# EasyEDA schematic Bravo-Flash Programmer.json
TITLE: Sheet_1; REV: 1.0; Date: 2021-12-21; Sheet: 1/1; Drawn By: kavehmajidi; Company: Your Company
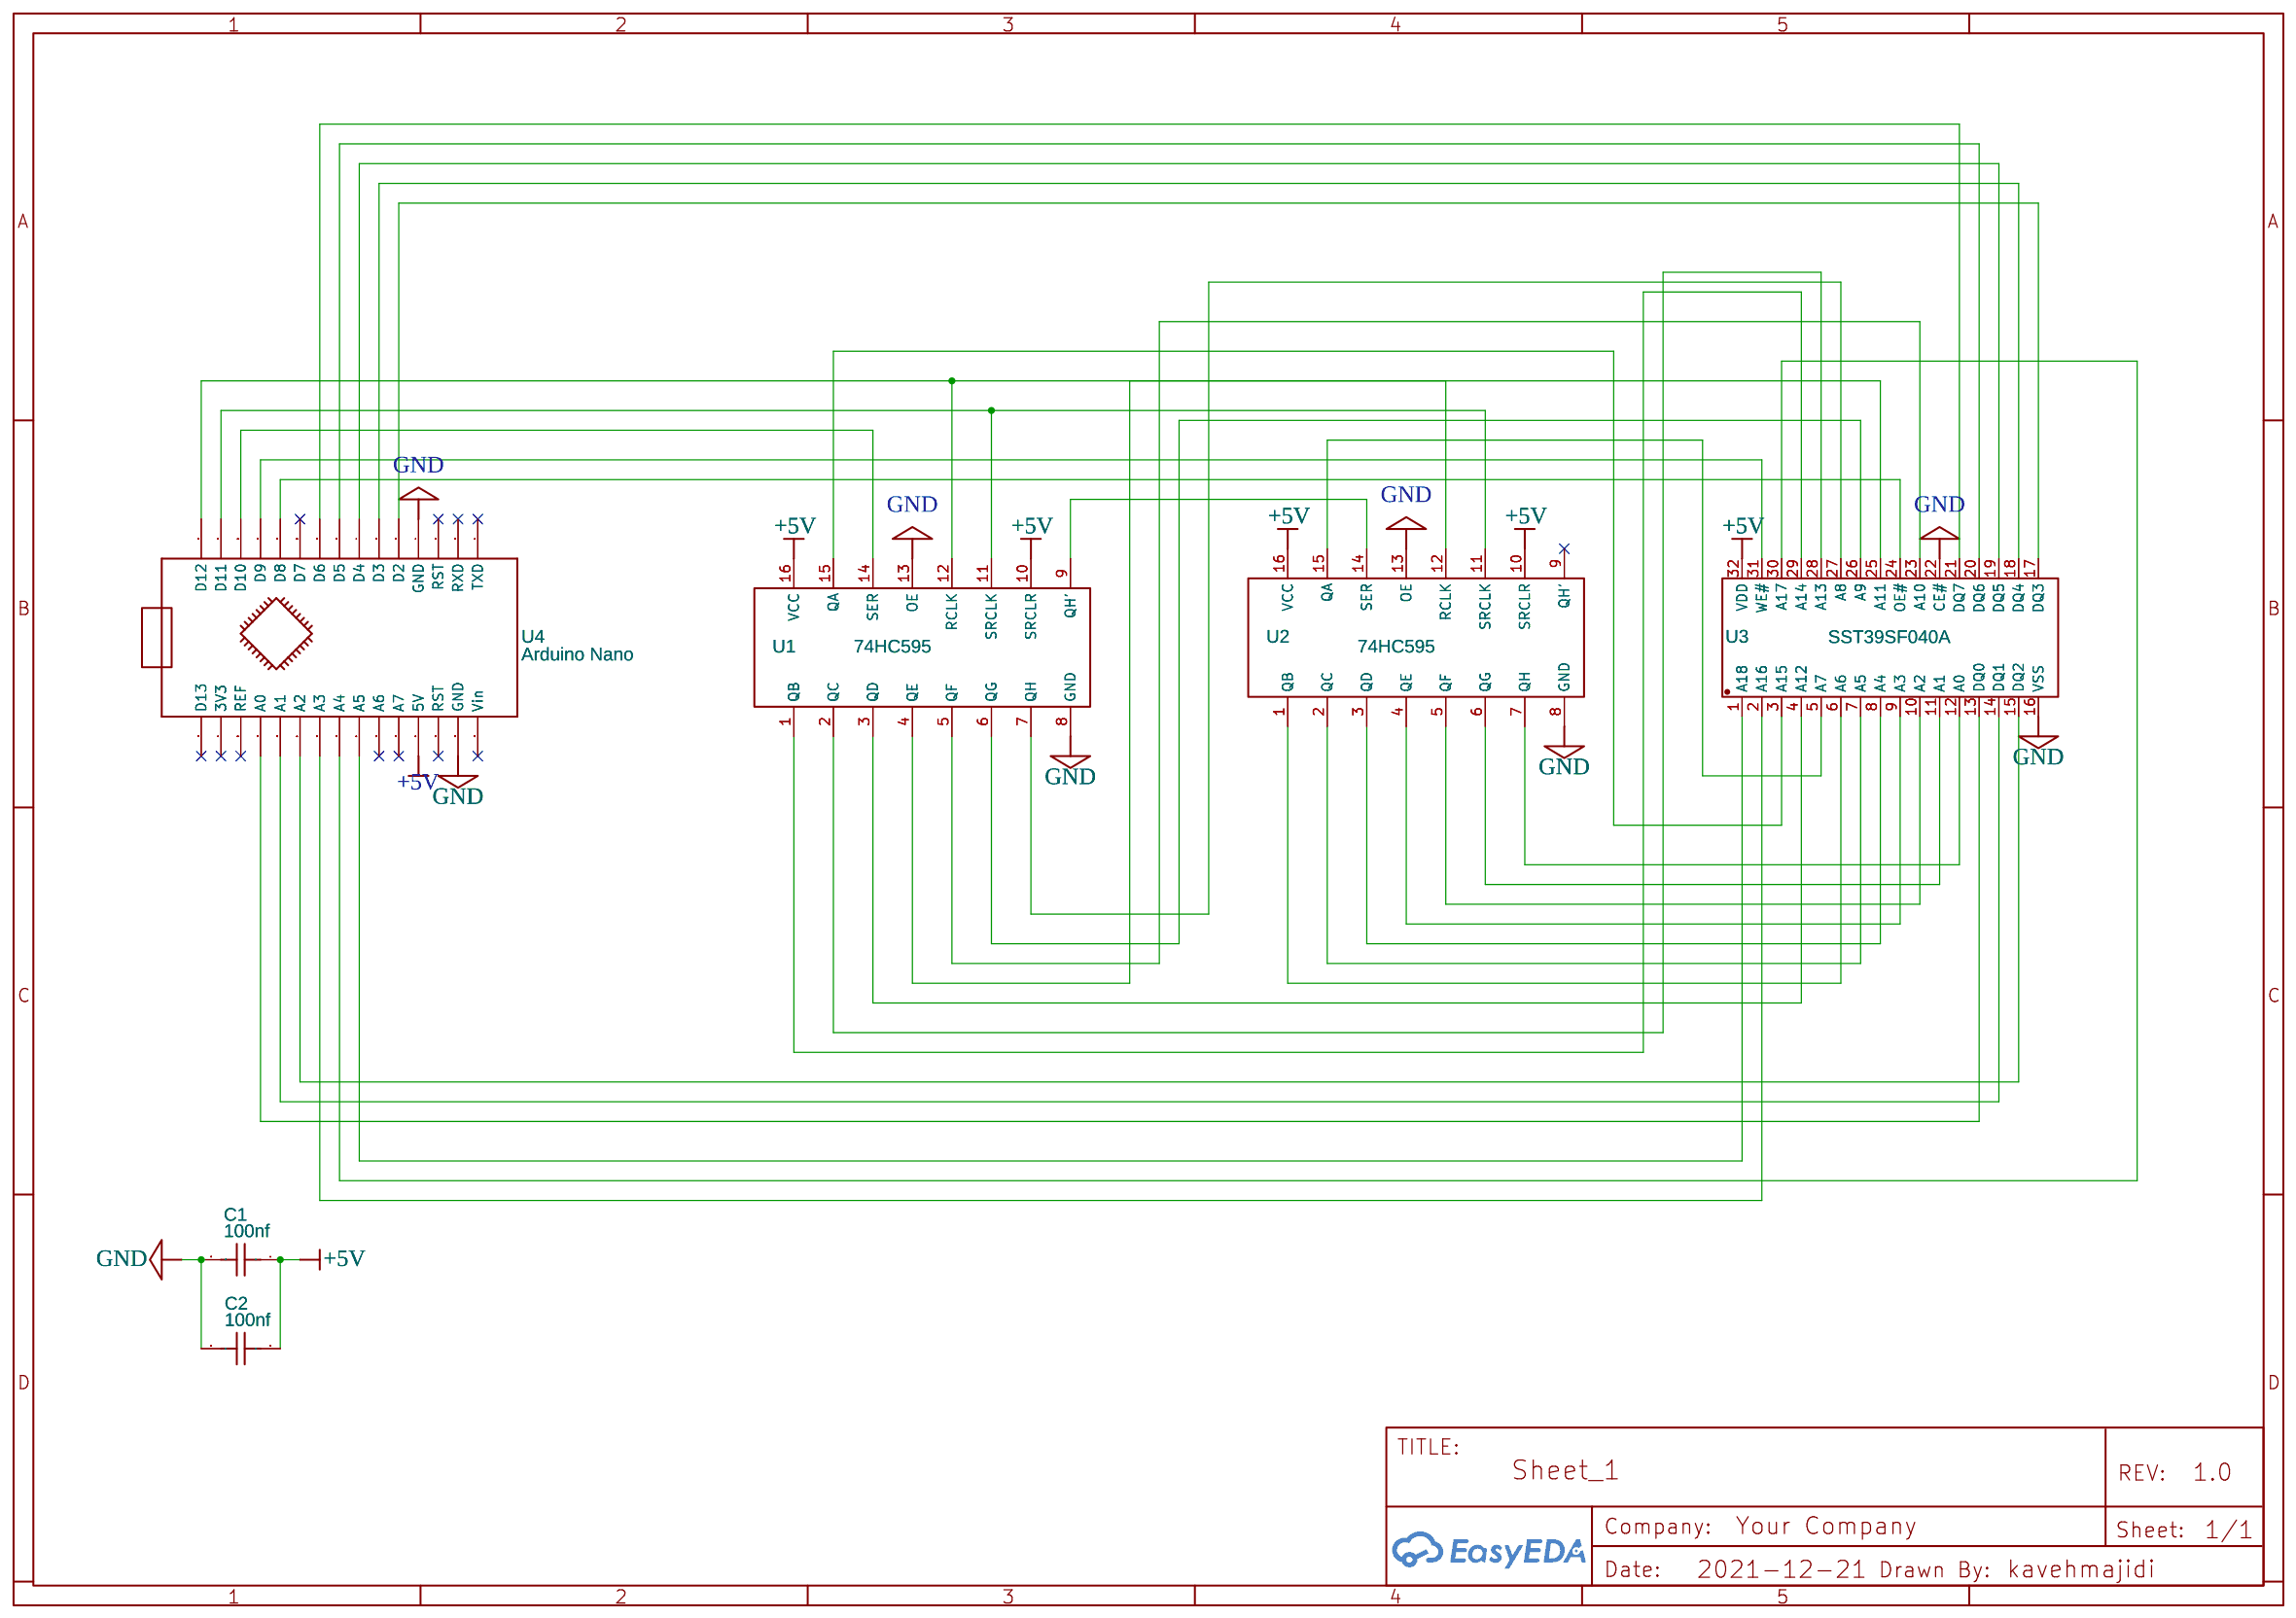
[diagram p0: schematic sheet]

## Parts
C1  100nf  [CAP-TH_L4.0-W2.5-P5.00-D1.0]
C2  100nf  [CAP-TH_L4.0-W2.5-P5.00-D1.0]
U1  74HC595  [74HC595]
U2  74HC595  [74HC595]
U3  SST39SF040A  [PDIP-32_L42.0-W13.7-P2.54-LS15.2-BL]
U4  Arduino Nano  [ARDUINO NANO VINCENT]

## Library data of the parts
C1 C2 = CC45SL3AD220JYVNA: Supplier: LCSC; Supplier Part: C342429; Manufacturer: TDK; Contributor: LCSC
U1 U2 = 74HC595: Contributor: geppox
U3 = SST39SF040-70-4C-PHE_C220176: Supplier: LCSC; Supplier Part: C220176; Manufacturer: Microchip Tech; Manufacturer Part: SST39SF040-70-4C-PHE; Contributor: LCSC; JLCPCB Part Class: Extended Part
U4 = Arduino Nano: Manufacturer Part: ArduinoNano; Contributor: lambertturtle

## Nets
+5V: C1.1 C2.1 U1.10(SRCLR) U1.16(VCC) U2.10(SRCLR) U2.16(VCC) U3.32(VDD) U4.27(5V)
GND: C1.2 C2.2 U1.8(GND) U1.13(OE) U2.8(GND) U2.13(OE) U3.16(VSS) U3.22(CE#) U4.4(GND) U4.29(GND)
Net-(U1-1): U1.1(QB) U3.29(A14)
Net-(U1-2): U1.2(QC) U3.28(A13)
Net-(U1-3): U1.3(QD) U3.4(A12)
Net-(U1-4): U1.4(QE) U3.25(A11)
Net-(U1-5): U1.5(QF) U3.23(A10)
Net-(U1-6): U1.6(QG) U3.26(A9)
Net-(U1-7): U1.7(QH) U3.27(A8)
Net-(U1-9): U1.9(QH') U2.14(SER)
Net-(U1-11): U1.11(SRCLK) U2.11(SRCLK) U4.14(D11)
Net-(U1-12): U1.12(RCLK) U2.12(RCLK) U4.15(D12)
Net-(U1-14): U1.14(SER) U4.13(D10)
Net-(U1-15): U1.15(QA) U3.3(A15)
Net-(U2-1): U2.1(QB) U3.6(A6)
Net-(U2-2): U2.2(QC) U3.7(A5)
Net-(U2-3): U2.3(QD) U3.8(A4)
Net-(U2-4): U2.4(QE) U3.9(A3)
Net-(U2-5): U2.5(QF) U3.10(A2)
Net-(U2-6): U2.6(QG) U3.11(A1)
Net-(U2-7): U2.7(QH) U3.12(A0)
Net-(U2-15): U2.15(QA) U3.5(A7)
Net-(U3-1): U3.1(A18) U4.24(A5)
Net-(U3-2): U3.2(A16) U4.22(A3)
Net-(U3-13): U3.13(DQ0) U4.19(A0)
Net-(U3-14): U3.14(DQ1) U4.20(A1)
Net-(U3-15): U3.15(DQ2) U4.21(A2)
Net-(U3-17): U3.17(DQ3) U4.5(D2)
Net-(U3-18): U3.18(DQ4) U4.6(D3)
Net-(U3-19): U3.19(DQ5) U4.7(D4)
Net-(U3-20): U3.20(DQ6) U4.8(D5)
Net-(U3-21): U3.21(DQ7) U4.9(D6)
Net-(U3-24): U3.24(OE#) U4.11(D8)
Net-(U3-30): U3.30(A17) U4.23(A4)
Net-(U3-31): U3.31(WE#) U4.12(D9)

Not connected (* = marked no-connect by the designer): U2 9(QH')*; U4 1(TXD)* 2(RXD)* 3(RST)* 10(D7)* 16(D13)* 17(3V3)* 18(REF)* 25(A6)* 26(A7)* 28(RST)* 30(Vin)*
